# Altium project Buck.PrjPcb
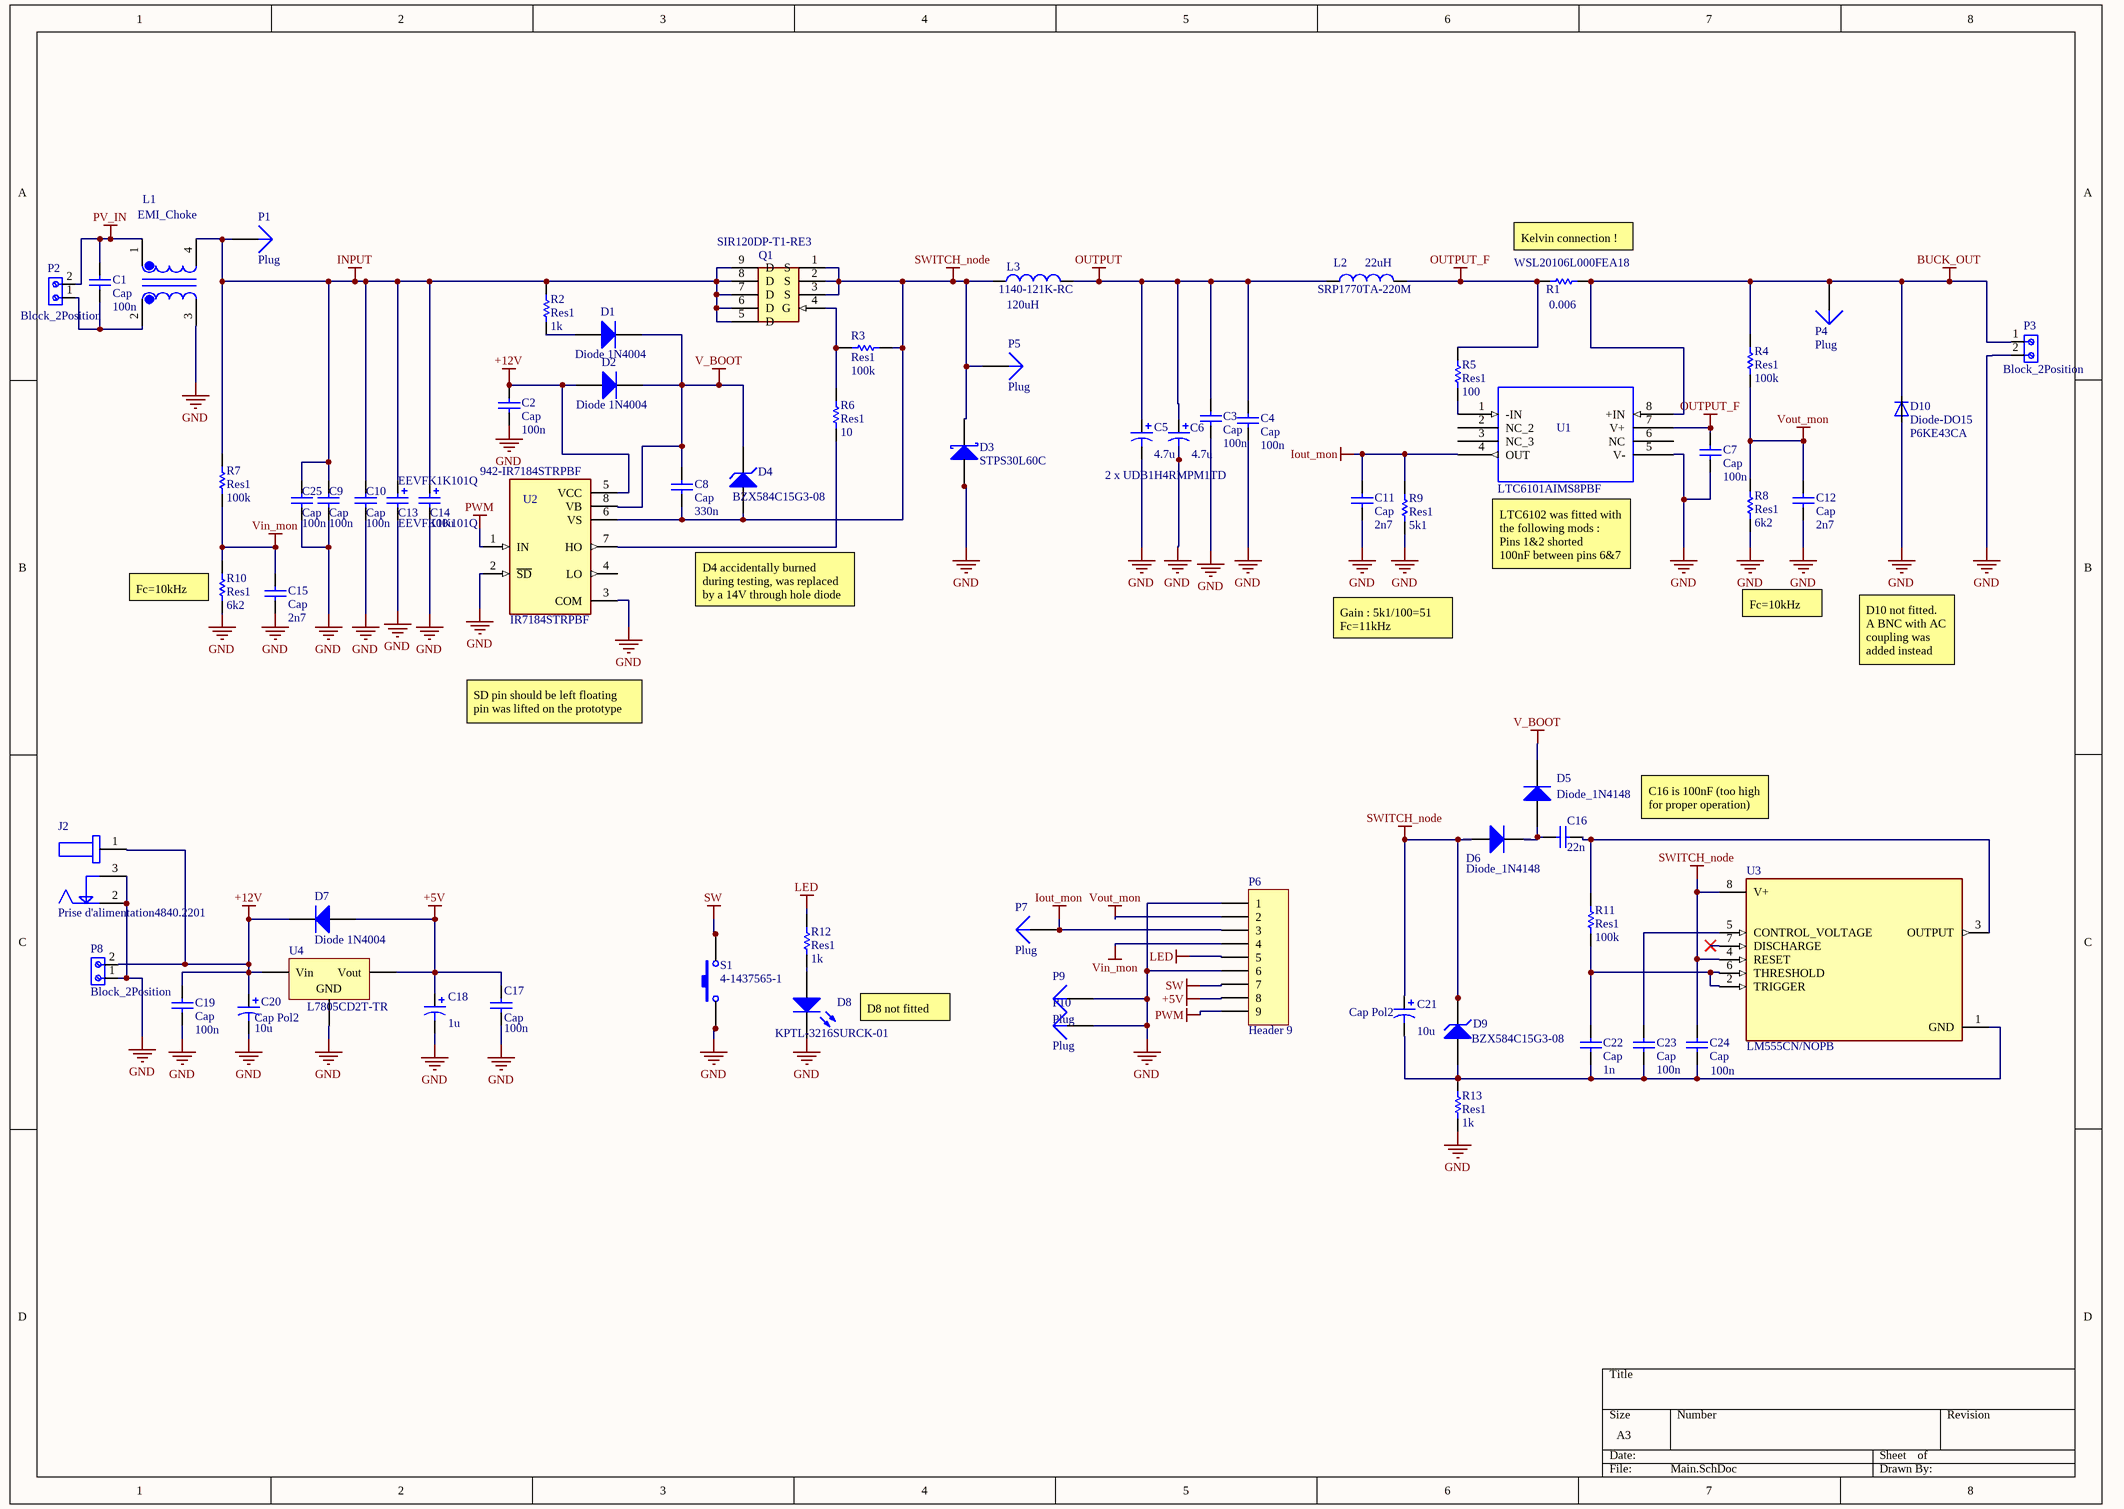
[diagram p0: Main.SchDoc]
1 sheet, 68 parts. Net scope: global (net labels, ports and power ports of the same name join across sheets).
Board files: main.PcbDoc, main_v2.PcbDoc

## Sheet Main.SchDoc
size A3

### Parts
C1  Cap  value 100n  [C0805]
C2  Cap  value 100n  [C0805]
C3  Cap  value 100n  [C0805]
C4  Cap  value 100n  [C0805]
C5  value 4.7u  [C1-C2]  (hidden comment: 2 x UDB1H4RMPM1TD)
C6  2 x UDB1H4RMPM1TD  value 4.7u  [C1-C2]
C7  Cap  value 100n  [C0805]
C8  Cap  value 330n  [C0805]
C9  Cap  value 100n  [C0805]
C10  Cap  value 100n  [C0805]
C11  Cap  value 2n7  [C0805]
C12  Cap  value 2n7  [C0805]
C13  EEVFK1K101Q  [C_Pol_EEV-FK1K101Q]
C14  EEVFK1K101Q  value 100u  [C_Pol_EEV-FK1K101Q]
C15  Cap  value 2n7  [C0805]
C16  22n  [C0805]
C17  Cap  value 100n  [C0805]
C18  1u  [C0805]
C19  Cap  value 100n  [C0805]
C20  Cap Pol2  value 10u  [C_10u]
C21  Cap Pol2  value 10u  [C_10u]
C22  Cap  value 1n  [C0805]
C23  Cap  value 100n  [C0805]
C24  Cap  value 100n  [C0805]
C25  Cap  value 100n  [C0805]
D1  Diode 1N4004  [diode_1N4004]
D2  Diode 1N4004  [diode_1N4004]
D3  STPS30L60C  [Diode_Scho]
D4  BZX584C15G3-08  [SOT-523]
D5  Diode_1N4148  [diode_1N4004]
D6  Diode_1N4148  [diode_1N4004]
D7  Diode 1N4004  [diode_1N4004]
D8  KPTL-3216SURCK-01  [LED]
D9  BZX584C15G3-08  [SOT-523]
D10  Diode-DO15  [DO15]
J2  Prise d'alimentation4840.2201  [Prise d'alimentation4840.2201]
L1  EMI_Choke  [EMI_Choke]
L2  SRP1770TA-220M  value 22uH  [SRP1770TA-220M]
L3  1140-121K-RC  value 120uH  [L_120]
P1  Plug  [PIN1]
P2  Block_2Position  [Block_2Position]
P3  Block_2Position  [Block_2Position]
P4  Plug  [PIN1]
P5  Plug  [PIN1]
P6  Header 9  [HDR1X9]
P7  Plug  [PIN1]
P8  Block_2Position  [Block_2Position]
P9  Plug  [PIN1]
P10  Plug  [PIN1]
Q1  SIR120DP-T1-RE3  [MOFET_SIR120DP-T1-RE3]
R1  WSL20106L000FEA18  value 0.006  [R0.006]
R2  Res1  value 1k  [R0805]
R3  Res1  value 100k  [R0805]
R4  Res1  value 100k  [R0805]
R5  Res1  value 100  [R0805]
R6  Res1  value 10  [R0805]
R7  Res1  value 100k  [R0805]
R8  Res1  value 6k2  [R0805]
R9  Res1  value 5k1  [R0805]
R10  Res1  value 6k2  [R0805]
R11  Res1  value 100k  [R0805]
R12  Res1  value 1k  [R0805]
R13  Res1  value 1k  [R0805]
S1  4-1437565-1  [Switch]
U1  LTC6101AIMS8PBF  [LTC6101AIMS8#PBF]
U2  IR7184STRPBF  Supplier Part Number 1: 942-IR7184STRPBF  [IR7184STRPBF]
U3  LM555CN/NOPB  [LM555CN/NOPB]
U4  L7805CD2T-TR  [Volt_Reg]

### Nets
+5V: C17.2 C18.1 D7.A P6.8 U4.3(Vout)
+12V: C2.2 C19.2 C20.1 D2.A D7.C(K) J2.1 P8.2 U2.5(VCC) U4.1(Vin)
BUCK_OUT: D10.C P3.1 P4.1 R1.1 R4.2 U1.8(+IN)
GND: C2.1 C3.1 C4.1 C5.2 C6.2 C7.1 C9.1 C10.1 C11.1 C12.1 C13.2 C14.2 C15.1 C17.1 C18.2 C19.1 C20.2 C25.1 D3.1(A) D3.3 D8.2(K) D10.A J2.2 J2.3 L1.3 P3.2 P6.1 P6.6 P8.1 P9.1 P10.1 R8.1 R9.1 R10.1 R13.2 S1.1 S1.2 U1.5(V-) U2.2(~{SD}) U2.3(COM) U4.4(GND)
INPUT: C9.2 C10.2 C13.1 C14.1 C25.2 L1.4 P1.1 Q1.5(D) Q1.6(D) Q1.7(D) Q1.8(D) Q1.9(D) R2.1 R7.2
Iout_mon: C11.2 P6.3 P7.1 R9.2 U1.4(OUT)
LED: P6.5 R12.1
OUTPUT: C3.2 C4.2 C5.1 C6.1 L2.1 L3.2
OUTPUT_F: C7.2 L2.2 R1.2 R5.2 U1.7(V+)
PV_IN: C1.2 L1.1 P2.2
PWM: P6.9 U2.1(IN)
SW: P6.7 S1.3 S1.4
SWITCH_node: C8.1 C21.1 C24.2 D3.4(K) D4.1 D6.A D9.2 L3.1 P5.1 Q1.1(S) Q1.2(S) Q1.3(S) R3.1 U2.6(VS) U3.4(RESET) U3.8(V+)
V_BOOT: C8.2 D1.C(K) D2.C(K) D4.2 D5.C U2.8(VB)
Vin_mon: C15.2 P6.4 R7.1 R10.2
Vout_mon: C12.2 P6.2 R4.1 R8.2
NetC1_1: C1.1 L1.2 P2.1
NetC16_1: C16.1 R11.2 U3.3(OUTPUT)
NetC16_2: C16.2 D5.A D6.C
NetC21_2: C21.2 C22.1 C23.1 C24.1 D9.1 R13.1 U3.1(GND)
NetC22_2: C22.2 R11.1 U3.2(TRIGGER) U3.6(THRESHOLD)
NetC23_2: C23.2 U3.5(CONTROL_VOLTAGE)
NetD1_A: D1.A R2.2
NetD8_1: D8.1(A) R12.2
NetQ1_4: Q1.4(G) R3.2 R6.2
NetR5_1: R5.1 U1.1(-IN)
NetR6_1: R6.1 U2.7(HO)

Not connected (* = marked no-connect by the designer): U1 2(NC_2) 3(NC_3) 6(NC); U2 4(LO); U3 7(DISCHARGE)*

### Notes on the sheet
- (near R1) Kelvin connection !
- (near U1) LTC6102 was fitted with the following mods :
  Pins 1&2 shorted
  100nF between pins 6&7
- (near R10) Fc=10kHz
- D4 accidentally burned during testing, was replaced by a 14V through hole diode
- Gain : 5k1/100=51
  Fc=11kHz
- Fc=10kHz
- SD pin should be left floating
  pin was lifted on the prototype
- D10 not fitted.
  A BNC with AC coupling was added instead
- C16 is 100nF (too high for proper operation)
- D8 not fitted

### Library data of the parts
C1-C4 C7 C9 C10 C17 C19 C23-C25 = Cap: Capacitor; Published: 8-Jun-2000; LatestRevisionDate: 17-Jul-2002; LatestRevisionNote: Re-released for DXP Platform.; PackageReference: RAD-0.3; Publisher: Altium Limited; PackageDescription: Radial Cap, Thru-Hole; 2 Leads; 0.3 in Pin Spacing; Supplier 1: Mouser
C5 C6 = Cap Pol2: Published: 8-Jun-2000; LatestRevisionDate: 17-Jul-2002; LatestRevisionNote: Re-released for DXP Platform.; PackageReference: POLAR0.8; Publisher: Altium Limited; PackageDescription: Polarized Capacitor; 2 Leads; Supplier 1: Digi-Key
C8 = Cap_2: Capacitor; Published: 8-Jun-2000; LatestRevisionDate: 17-Jul-2002; LatestRevisionNote: Re-released for DXP Platform.; PackageReference: RAD-0.3; Publisher: Altium Limited; PackageDescription: Radial Cap, Thru-Hole; 2 Leads; 0.3 in Pin Spacing; Supplier 1: Mouser
C11 C12 C15 = Cap_1: Capacitor; Published: 8-Jun-2000; LatestRevisionDate: 17-Jul-2002; LatestRevisionNote: Re-released for DXP Platform.; PackageReference: RAD-0.3; Publisher: Altium Limited; PackageDescription: Radial Cap, Thru-Hole; 2 Leads; 0.3 in Pin Spacing; Supplier 1: Mouser
C13 = Cap Pol2_1: Polarized Capacitor (Axial); Value: 100u; Published: 8-Jun-2000; LatestRevisionDate: 17-Jul-2002; LatestRevisionNote: Re-released for DXP Platform.; PackageReference: POLAR0.8; Publisher: Altium Limited; PackageDescription: Polarized Capacitor; 2 Leads; Supplier 1: Mouser
C14 = Cap Pol2_1: Polarized Capacitor (Axial); Published: 8-Jun-2000; LatestRevisionDate: 17-Jul-2002; LatestRevisionNote: Re-released for DXP Platform.; PackageReference: POLAR0.8; Publisher: Altium Limited; PackageDescription: Polarized Capacitor; 2 Leads; Supplier 1: Mouser
C16 = Cap_22n: Value: 22n; Parameter 2: *
C18 = C_4: Parameter 2: *; Valeur: 1u
C20 C21 = Cap Pol2_2: Polarized Capacitor (Axial); Published: 8-Jun-2000; LatestRevisionDate: 17-Jul-2002; LatestRevisionNote: Re-released for DXP Platform.; PackageReference: POLAR0.8; Publisher: Altium Limited; PackageDescription: Polarized Capacitor; 2 Leads; Supplier 1: Mouser
C22 = Cap_3: Capacitor; Published: 8-Jun-2000; LatestRevisionDate: 17-Jul-2002; LatestRevisionNote: Re-released for DXP Platform.; PackageReference: RAD-0.3; Publisher: Altium Limited; PackageDescription: Radial Cap, Thru-Hole; 2 Leads; 0.3 in Pin Spacing; Supplier 1: Mouser
D1 D2 D7 = Diode 1N4004: 1 Amp General Purpose Rectifier; Published: 8-Jun-2000; LatestRevisionDate: 17-Jul-2002; LatestRevisionNote: Re-released for DXP Platform.; DatasheetVersion: 1998; PackageVersion: Aug-1999; PackageReference: DO-41; Publisher: Altium Limited; PackageDescription: Diode, Axial; Body 5.2 x 2.7 mm (LxDia. max), Lead Dia. 0.86 mm (max); Code_JEDEC: DO-204-AL; ComponentLink1Description: Manufacturer Link; ComponentLink1URL: http://www.fairchildsemi.com/; ComponentLink2Description: Datasheet; ComponentLink2URL: http://www.fairchildsemi.com/ds/1N%2F1N4001.pdf; Supplier 1: Digi-Key
D3 = D Schottky: Schottky Diode; Published: 8-Jun-2000; LatestRevisionDate: 17-Jul-2002; LatestRevisionNote: Re-released for DXP Platform.; PackageReference: SMB; Publisher: Altium Limited; PackageDescription: DO-214-AA/SMB; 2 C-Bend Leads; Body 5.3 x 3.6 mm, inc. leads (LxW); Code_JEDEC: DO-214-AA
D4 D9 = D Zener: Zener Diode 15V; Published: 8-Jun-2000; LatestRevisionDate: 17-Jul-2002; LatestRevisionNote: Re-released for DXP Platform.; PackageReference: DIODE-0.7; Publisher: Altium Limited; PackageDescription: Diode, Thru-Hole; 2 Leads; 0.7 in Pin Spacing; Supplier 1: Mouser
D8 = LED2: Typical RED, GREEN, YELLOW, AMBER GaAs LED; Published: 8-Jun-2000; LatestRevisionDate: 17-Jul-2002; LatestRevisionNote: Re-released for DXP Platform.; PackageVersion: Feb-2002; PackageReference: 3.2X1.6X1.1; Publisher: Altium Limited; PackageDescription: SM LED; 2 Flat Leads; Supplier 1: Farnell
D10 = Diode-DO15: P6KE43CA; Tension: 43V; Ref: P6KE43CA
L1 = EMI_Choke: 1mH 20A
L3 = Inductor: Code_IEC: 1005; Published: 8-Jun-2000; LatestRevisionDate: 29-May-2009; LatestRevisionNote: IPC-7351 Footprint Added.; PackageReference: 0402-A; Publisher: Altium Limited; PackageDescription: Chip Inductor; Code_JEITA: 0402; Supplier 1: Mouser
P6 = Header 9: Header, 9-Pin; LatestRevisionDate: 17-Jul-2002; LatestRevisionNote: Re-released for DXP Platform.; Publisher: Altium Limited
R1 = Res1_2: Resistor; Published: 8-Jun-2000; LatestRevisionDate: 17-Jul-2002; LatestRevisionNote: Re-released for DXP Platform.; PackageReference: AXIAL-0.3; Publisher: Altium Limited; PackageDescription: Axial Device, Thru-Hole; 2 Leads; 0.3 in Pin Spacing; Supplier 1: Mouser
R2 R12 R13 = Res1_6: Resistor; Published: 8-Jun-2000; LatestRevisionDate: 17-Jul-2002; LatestRevisionNote: Re-released for DXP Platform.; PackageReference: AXIAL-0.3; Publisher: Altium Limited; PackageDescription: Axial Device, Thru-Hole; 2 Leads; 0.3 in Pin Spacing; Supplier 1: Mouser
R3 R4 R7 R11 = Res1: Resistor; Published: 8-Jun-2000; LatestRevisionDate: 17-Jul-2002; LatestRevisionNote: Re-released for DXP Platform.; PackageReference: AXIAL-0.3; Publisher: Altium Limited; PackageDescription: Axial Device, Thru-Hole; 2 Leads; 0.3 in Pin Spacing; Supplier 1: Digi-Key; Supplier 2: Mouser
R5 = Res1_3: Resistor; Published: 8-Jun-2000; LatestRevisionDate: 17-Jul-2002; LatestRevisionNote: Re-released for DXP Platform.; PackageReference: AXIAL-0.3; Publisher: Altium Limited; PackageDescription: Axial Device, Thru-Hole; 2 Leads; 0.3 in Pin Spacing; Supplier 1: Mouser
R6 = Res1_5: Resistor; Published: 8-Jun-2000; LatestRevisionDate: 17-Jul-2002; LatestRevisionNote: Re-released for DXP Platform.; PackageReference: AXIAL-0.3; Publisher: Altium Limited; PackageDescription: Axial Device, Thru-Hole; 2 Leads; 0.3 in Pin Spacing; Supplier 1: Mouser
R8 R10 = Res1_1: Resistor; Published: 8-Jun-2000; LatestRevisionDate: 17-Jul-2002; LatestRevisionNote: Re-released for DXP Platform.; PackageReference: AXIAL-0.3; Publisher: Altium Limited; PackageDescription: Axial Device, Thru-Hole; 2 Leads; 0.3 in Pin Spacing; Supplier 1: Mouser
R9 = Res1_4: Resistor; Published: 8-Jun-2000; LatestRevisionDate: 17-Jul-2002; LatestRevisionNote: Re-released for DXP Platform.; PackageReference: AXIAL-0.3; Publisher: Altium Limited; PackageDescription: Axial Device, Thru-Hole; 2 Leads; 0.3 in Pin Spacing; Supplier 1: Mouser
S1 = SW-PB: Switch; Published: 24-Mar-1999; LatestRevisionDate: 17-Jul-2002; LatestRevisionNote: Re-released for DXP Platform.; PackageReference: SPST-2; Publisher: Altium Limited; PackageDescription: Switch; 2 Leads; Supplier 1: Mouser
U1 = LTC6101AIMS8PBF: SP Amp Current Sense Amp Single 60V Automotive 8-Pin MSOP Tube; MF: Analog Devices; MP: LTC6101AIMS8#PBF; SnapEDA_Link: https://www.snapeda.com/parts/LTC6101AIMS8%23PBF/Analog%20Devices/view-part/4331140/?ref=snap; Price: None; Purchase-URL: https://pricing.snapeda.com/search/part/LTC6101AIMS8#PBF/?ref=eda; Package: MSOP-8 Analog Devices; Availability: Warning; Value: *; Check_prices: https://www.snapeda.com/parts/LTC6101AIMS8%23PBF/Analog%20Devices/view-part/4331140/?ref=eda; Supplier 1: Mouser
U2 = IR7184STRPBF: Drives IGBT/MOSFET power devices | Gate drive supplies up to 20 V per channel | Integrated deadtime protection | Shoot-through _cross-conduction_ protection | Undervoltage lockout for VCC for VBS | 3.3 V, 5 V , 15 V input logic compatible | Tolerant to negative transient voltage | Designed for use with bootstrap power supplies | Matched propagation delays | -40C to 125C operating range; MF: Infineon Technologies; Value: *; MP: IR7184STRPBF; Package: SOIC-8 Infineon; Price: None; Availability: Unavailable; SnapEDA_Link: https://www.snapeda.com/parts/IR7184STRPBF/Infineon%20Technologies/view-part/1224754/?ref=snap; Supplier 1: Mouser
U4 = Volt Reg: Voltage Regulator; Published: 24-Mar-1999; LatestRevisionDate: 29-May-2009; LatestRevisionNote: IPC-7351 Footprint Added.; PackageReference: D2PAK; Publisher: Altium Limited; PackageDescription: 3-Pin Transistor Outline Package 2.54 mm Pitch, 15.1 mm Lead Span; Supplier 1: Mouser
P1 P4 P5 P7 P9 P10 = Plug: LatestRevisionDate: 17-Jul-2002; LatestRevisionNote: Re-released for DXP Platform.; Publisher: Altium Limited
U3 = LM555CN/NOPB: Value: *; Availability: Unavailable; Package: None; MP: LM555CN/NOPB; Price: None; Supplier 1: Mouser